# EAGLE design custom_components (EAGLE 6.1)
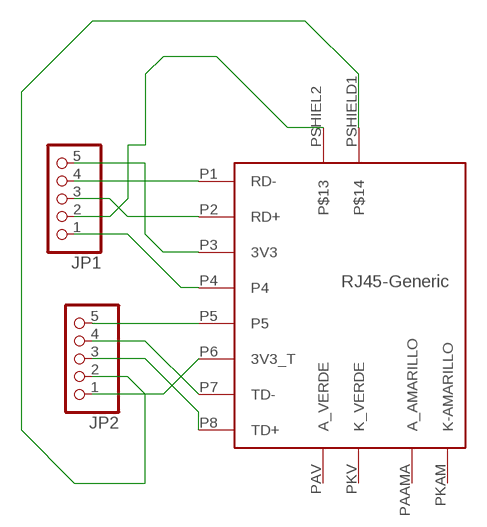
[diagram p0: schematic, sheet 1]

## Parts
JP1  PINHD-1X5  [1X05]
JP2  PINHD-1X5  [1X05]
U$2  RJ-45-GENERIC  [RJ45-GENERIC]

## Nets
N$1: JP1.5 U$2.P3(3V3)
N$2: JP1.4 U$2.P1(RD-)
N$3: JP1.3 U$2.P2(RD+)
N$4: JP1.2 U$2.PSHIEL2
N$5: JP1.1 U$2.P4
N$6: JP2.5 U$2.P5
N$7: JP2.4 U$2.P7(TD-)
N$8: JP2.3 U$2.P8(TD+)
N$9: JP2.2 U$2.PSHIELD1
N$10: JP2.1 U$2.P6(3V3_T)
Unconnected: U$2.PAAMA(A_AMARILLO) U$2.PAV(A_VERDE) U$2.PKAM(K-AMARILLO) U$2.PKV(K_VERDE)

## Library data of the parts
JP1 JP2 = pinhead:PINHD-1X5: PIN HEADER
U$2 = RJ45:RJ-45-GENERIC

## Board
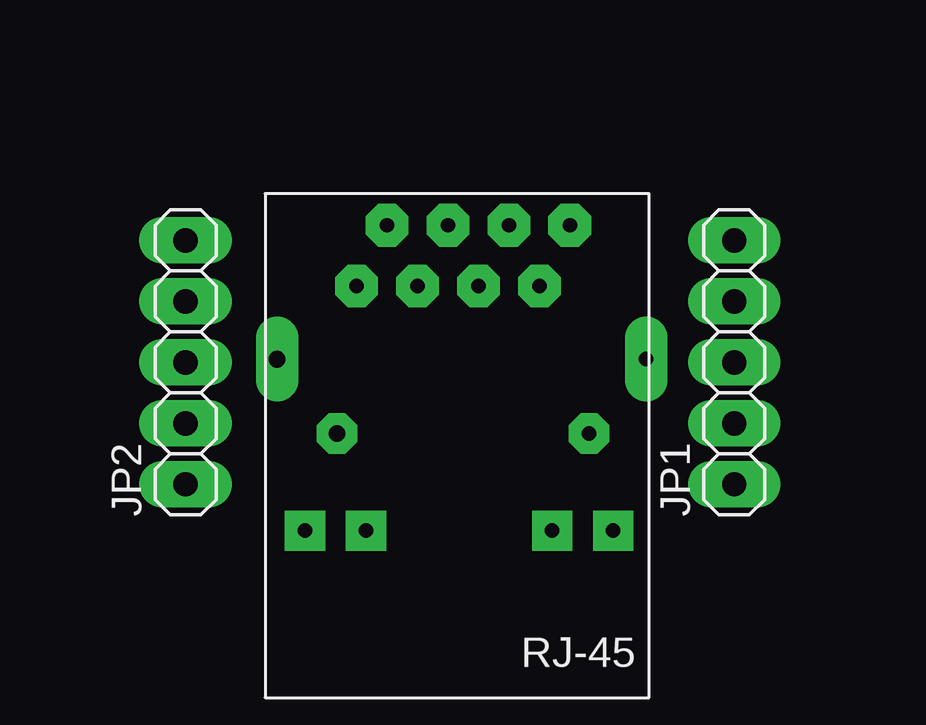
[diagram p1: board, top side]
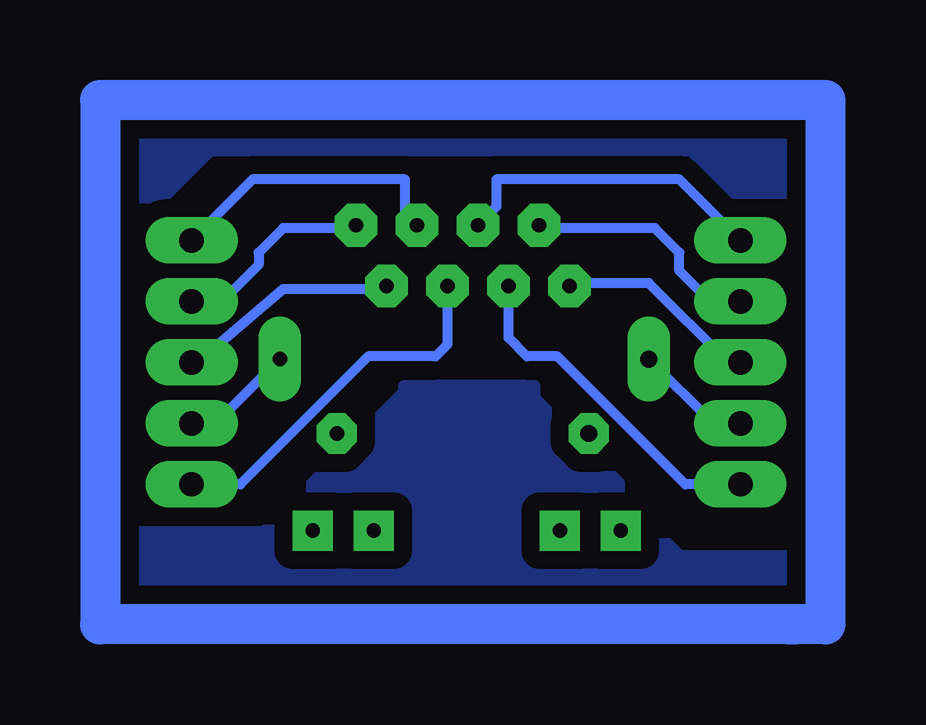
[diagram p2: board, bottom side, seen from below]

No outline drawn. Coordinates in mm, seen from the top.
Copper layers (1*16): Top 0.035mm / dielectric 1.5mm / Bottom 0.035mm
Design rules: minimum track width 10mil, minimum drill 24mil, track to track 30mil, track to pad 30mil, pad to pad 30mil, via to via 30mil, smd to smd 18mil, copper to edge 40mil, drill to drill 8mil, minimum pad ring 18mil, minimum via ring 18mil, stop-mask expansion 4mil, vias tented up to drill 0mil, thermal gap 10mil

### Footprints (pad centres in the part's own frame; a part is rotated, then mirrored left to right if it is on the bottom)
1X05 = drill 1.016 long: 1 -5.08,0; 2 -2.54,0; 3 0,0; 4 2.54,0; 5 5.08,0
RJ45-GENERIC = drill 0.6 pad 1.778 octagon: P1 12.2,19.685; P2 10.93,17.145; P3 9.66,19.685; P4 8.39,17.145; P5 7.12,19.685; P6 5.85,17.145; P7 4.58,19.685; P8 3.31,17.145 | drill 0.6 pad 1.676 square: PAAMA 1.17,6.958; PAV 11.465,6.958; PKAM 3.71,6.958; PKV 14.005,6.958 | drill 0.6 pad 1.778 long: PSHIEL2 15.375,14.105 | drill 0.7 pad 1.778 long: PSHIELD1 0,14.105 | drill 0.7 pad 1.676 octagon: PSTAND 2.5,11.008 | drill 0.6 pad 1.676 octagon: PSTAND2 13,11.008

### Placement (x,y rotation side)
JP1  24.13,16.51 90 top
JP2  1.27,16.51 90 top
U$2  5.08,2.54 0 top

### Tracks (layer width: path | path; a pad name or v marks a point on that pad's centre or on a via)
GND
  pour Bottom: 9.91,15.49 9.91,14.99 6.35,11.43 6.35,10.92 3.81,8.38 -1.27,8.38 -1.27,6.35 27.18,6.35 27.18,9.4 21.08,9.4 18.03,12.45 15.24,15.24 15.24,15.49
  pour Bottom: -1.52,26.67 -1.52,23.62 1.52,23.62 3.3,25.4 23.37,25.4 25.65,23.11 27.18,23.11 27.18,26.67
N$1
  Bottom 0.406: U$2.P3 14.74,22.36 15.24,22.86 15.24,24.13 21.59,24.13 JP1.5
N$2
  Bottom 0.406: JP1.4 22.86,19.05 21.34,20.57 21.34,21.08 20.32,22.1 17.41,22.1 U$2.P1
N$3
  Bottom 0.406: JP1.3 23.88,16.51 20.32,19.56 16.14,19.56 U$2.P2
N$4
  Bottom 0.406: JP1.2 23.13,13.97 U$2.PSHIEL2
N$5
  Bottom 0.406: JP1.1 22.1,11.43 16.76,16.76 13.97,16.76 13.46,17.27 U$2.P4
N$6
  Bottom 0.406: JP2.5 3.81,24.13 11.43,24.13 11.43,23 U$2.P5
N$7
  Bottom 0.406: JP2.4 2.54,19.05 3.81,20.32 3.81,21.08 4.83,22.1 9.53,22.1 U$2.P7
N$8
  Bottom 0.406: JP2.3 1.78,16.51 5.08,19.81 8.26,19.81 U$2.P8
N$9
  Bottom 0.406: JP2.2 2.4,13.97 U$2.PSHIELD1
N$10
  Bottom 0.406: JP2.1 3.56,11.43 8.89,16.76 10.16,16.76 10.92,17.53 U$2.P6
N$11
  Bottom 1.676: -1.02,5.59 -0.76,5.59 27.94,5.59 27.94,27.43 -2.29,27.43 -2.29,5.59 -1.02,5.59